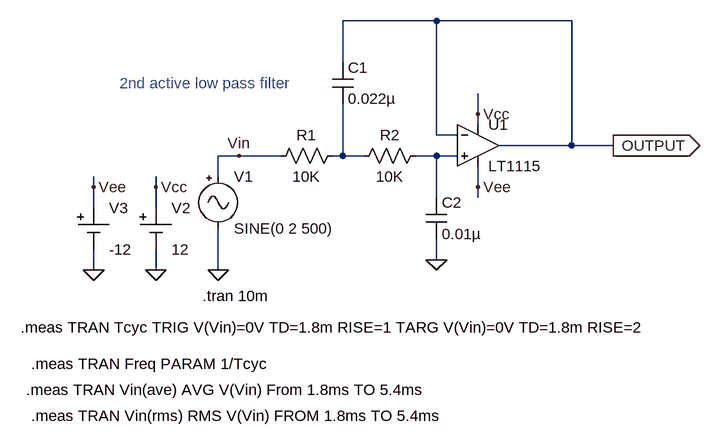
[diagram p0: schematic lpf.asc]
lpf.asc, the LTspice schematic file:
Version 4
SHEET 1 880 680
WIRE 128 -80 -16 -80
WIRE 336 -80 128 -80
WIRE -16 -16 -16 -80
WIRE 192 64 192 32
WIRE 192 80 192 64
WIRE 128 96 128 -80
WIRE 160 96 128 96
WIRE 336 112 336 -80
WIRE 336 112 224 112
WIRE 400 112 336 112
WIRE -176 128 -208 128
WIRE -112 128 -176 128
WIRE -16 128 -16 48
WIRE -16 128 -32 128
WIRE 16 128 -16 128
WIRE 128 128 96 128
WIRE 160 128 128 128
WIRE -208 160 -208 128
WIRE -400 176 -400 160
WIRE -304 176 -304 160
WIRE 192 176 192 144
WIRE 128 192 128 128
WIRE 192 192 192 176
WIRE -400 208 -400 176
WIRE -304 208 -304 176
WIRE 128 288 128 256
WIRE -400 304 -400 272
WIRE -304 304 -304 272
WIRE -208 304 -208 240
FLAG -208 304 0
FLAG -304 304 0
FLAG -400 304 0
FLAG 128 288 0
FLAG -176 128 Vin
FLAG 400 112 OUTPUT
IOPIN 400 112 Out
FLAG 192 64 Vcc
FLAG 192 176 Vee
FLAG -304 176 Vcc
FLAG -400 176 Vee
SYMBOL OpAmps\\LT1115 192 48 R0
SYMATTR InstName U1
SYMBOL res -16 112 R90
WINDOW 0 0 56 VBottom 2
WINDOW 3 32 56 VTop 2
SYMATTR InstName R1
SYMATTR Value 10K
SYMATTR SpiceLine tol=1 pwr=0.1
SYMBOL res 112 112 R90
WINDOW 0 0 56 VBottom 2
WINDOW 3 32 56 VTop 2
SYMATTR InstName R2
SYMATTR Value 10K
SYMATTR SpiceLine tol=1 pwr=0.1
SYMBOL cap -32 -16 R0
SYMATTR InstName C1
SYMATTR Value 0.022µ
SYMATTR SpiceLine V=50 Irms=0 Rser=0 Lser=0 mfg="Murata" pn="GCM155R71H223KA55" type="X7R"
SYMBOL cap 112 192 R0
SYMATTR InstName C2
SYMATTR Value 0.01µ
SYMATTR SpiceLine V=50 Irms=0 Rser=0 Lser=0 mfg="Murata" pn="GCM155R71H103KA55" type="X7R"
SYMBOL Misc\\signal -208 144 R0
WINDOW 123 0 0 Left 0
WINDOW 39 0 0 Left 0
SYMATTR InstName V1
SYMATTR Value SINE(0 2 500)
SYMBOL Misc\\cell -304 208 R0
WINDOW 123 0 0 Left 0
WINDOW 39 0 0 Left 0
SYMATTR InstName V2
SYMATTR Value 12
SYMBOL Misc\\cell -400 208 R0
WINDOW 123 0 0 Left 0
WINDOW 39 0 0 Left 0
SYMATTR InstName V3
SYMATTR Value -12
TEXT -360 16 Left 2 ;2nd active low pass filter
TEXT -232 344 Left 2 !.tran 10m
TEXT -512 392 Left 2 !.meas TRAN Tcyc TRIG V(Vin)=0V TD=1.8m RISE=1 TARG V(Vin)=0V TD=1.8m RISE=2
TEXT -496 448 Left 2 !.meas TRAN Freq PARAM 1/Tcyc
TEXT -504 488 Left 2 !.meas TRAN Vin(ave) AVG V(Vin) From 1.8ms TO 5.4ms
TEXT -496 528 Left 2 !.meas TRAN Vin(rms) RMS V(Vin) FROM 1.8ms TO 5.4ms

The netlist it stands for:
* lpf.asc
XU1 N002 OUTPUT Vcc Vee OUTPUT LT1028  ; LT1115, pins In+ In- V+ V- OUT
R1 N001 Vin 10K tol=1 pwr=0.1
R2 N002 N001 10K tol=1 pwr=0.1
C1 OUTPUT N001 0.022µ V=50 Irms=0 Rser=0 Lser=0 mfg="Murata" pn="GCM155R71H223KA55" type="X7R"
C2 N002 0 0.01µ V=50 Irms=0 Rser=0 Lser=0 mfg="Murata" pn="GCM155R71H103KA55" type="X7R"
V1 Vin 0 SINE(0 2 500)
V2 Vcc 0 12
V3 Vee 0 -12
* 2nd active low pass filter
.tran 10m
.meas TRAN Tcyc TRIG V(Vin)=0V TD=1.8m RISE=1 TARG V(Vin)=0V TD=1.8m RISE=2
.meas TRAN Freq PARAM 1/Tcyc
.meas TRAN Vin(ave) AVG V(Vin) From 1.8ms TO 5.4ms
.meas TRAN Vin(rms) RMS V(Vin) FROM 1.8ms TO 5.4ms
.lib LTC.lib
.backanno
.end

* Results of the author's LTspice run, read from the files saved beside the schematic
* Operating Point, zero values left out:
*   V(vcc) = 12 V
*   V(vee) = -12 V
*   I(V3) = 7.391 mA
*   I(V2) = -7.391 mA
*   Ix(u1:3) = 7.391 mA
*   Ix(u1:4) = -7.391 mA
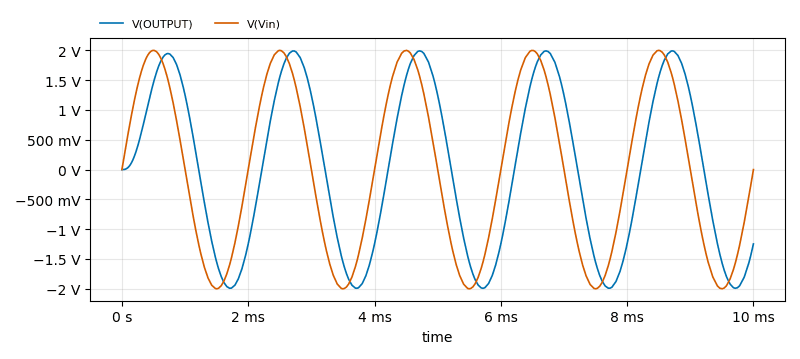
[diagram p1: Transient Analysis of lpf.asc, plotted from the saved traces]
* Transient Analysis, 1 run:
*   V(OUTPUT): min -1.992 V, max 1.992 V, average 14.26 mV, rms 1.401 V, last -1.247 V
*   V(Vin): min -2 V, max 2 V, average 98.4 µV, rms 1.414 V, last 0 V
* From the log:
*   tcyc=0.002 FROM 0.002 TO 0.004
*   freq: 1/tcyc=499.999
*   vin(ave): AVG(v(vin))=0.197699 FROM 0.0018 TO 0.0054
*   vin(rms): RMS(v(vin))=1.36521 FROM 0.0018 TO 0.0054